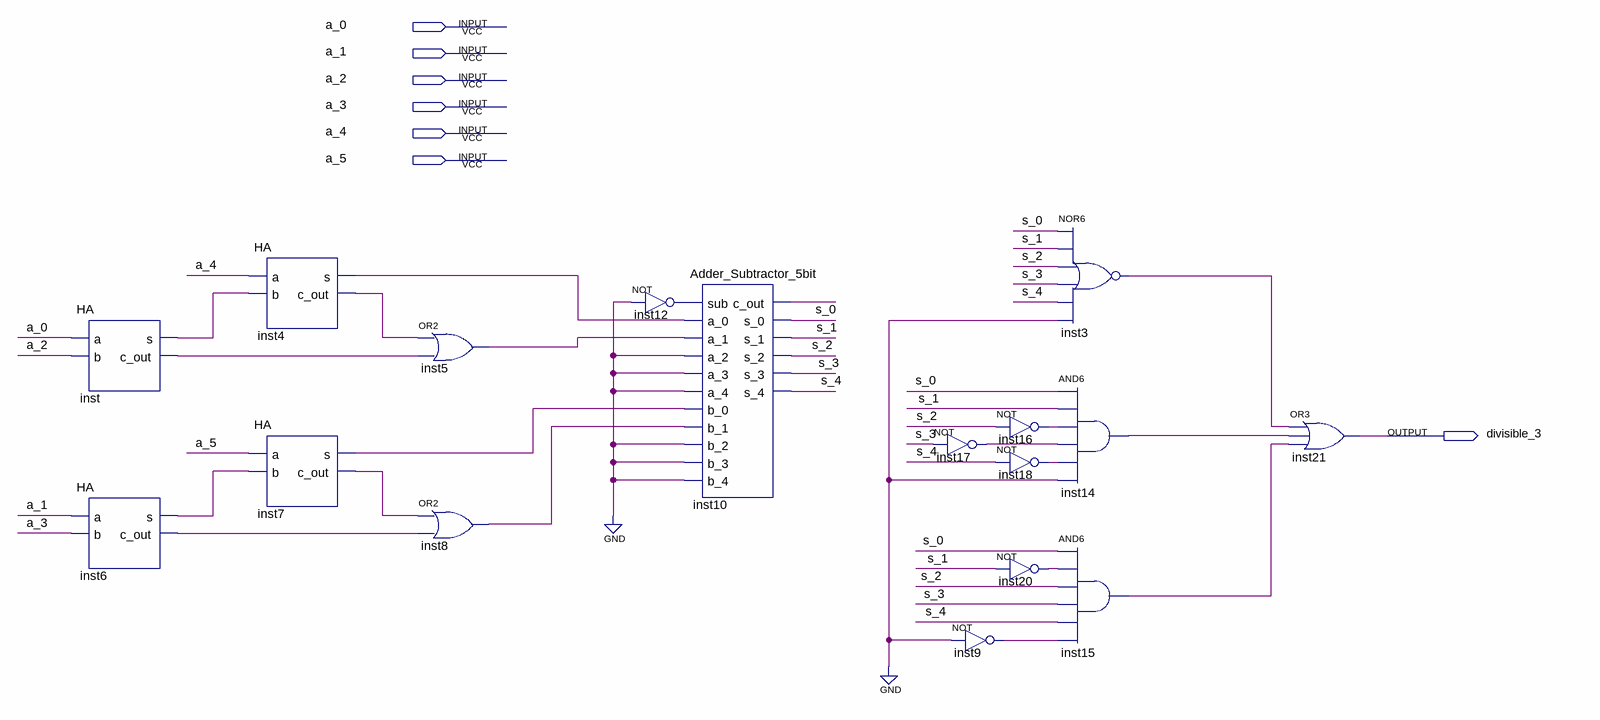
[diagram p0: schematic sheet]
// Quartus schematic DIV_3.bdf as structural Verilog: 17 symbols, 7 pins
module DIV_3 (
  input  a_0,
  input  a_1,
  input  a_2,
  input  a_3,
  input  a_4,
  input  a_5,
  output divisible_3
);

  wire inst3_out, inst4_c_out, inst4_s, inst5_out, inst6_c_out, inst6_s, inst7_c_out, inst7_s, inst8_out,
       inst9_out, inst10_c_out, inst12_out, inst14_out, inst15_out, inst16_out, inst17_out, inst18_out,
       inst20_out, inst_c_out, inst_s, s_0, s_1, s_2, s_3, s_4;

  HA inst (.a(a_0), .b(a_2), .s(inst_s), .c_out(inst_c_out));
  HA inst6 (.a(a_1), .b(a_3), .s(inst6_s), .c_out(inst6_c_out));
  HA inst4 (.a(a_4), .b(inst_s), .s(inst4_s), .c_out(inst4_c_out));
  HA inst7 (.a(a_5), .b(inst6_s), .s(inst7_s), .c_out(inst7_c_out));
  or inst5 (inst5_out, inst4_c_out, inst_c_out);
  or inst8 (inst8_out, inst7_c_out, inst6_c_out);
  Adder_Subtractor_5bit inst10 (
    .sub(inst12_out), .a_0(inst4_s), .a_1(inst5_out), .a_2(1'b0), .a_3(1'b0), .a_4(1'b0), .b_0(inst7_s),
    .b_1(inst8_out), .b_2(1'b0), .b_3(1'b0), .b_4(1'b0), .c_out(inst10_c_out), .s_0(s_0), .s_1(s_1),
    .s_2(s_2), .s_3(s_3), .s_4(s_4));
  not inst12 (inst12_out, 1'b0);
  not inst17 (inst17_out, s_3);
  not inst9 (inst9_out, 1'b0);
  not inst16 (inst16_out, s_2);
  not inst18 (inst18_out, s_4);
  not inst20 (inst20_out, s_1);
  nor inst3 (inst3_out, s_0, s_1, s_2, s_3, s_4, 1'b0);
  and inst14 (inst14_out, s_0, s_1, inst16_out, inst17_out, inst18_out, 1'b0);
  and inst15 (inst15_out, s_0, inst20_out, s_2, s_3, s_4, inst9_out);
  or inst21 (divisible_3, inst3_out, inst14_out, inst15_out);
endmodule
